# Altium schematic sheet main_logic.SchDoc
size A3; SheetNumber: 1; SheetTotal: 2
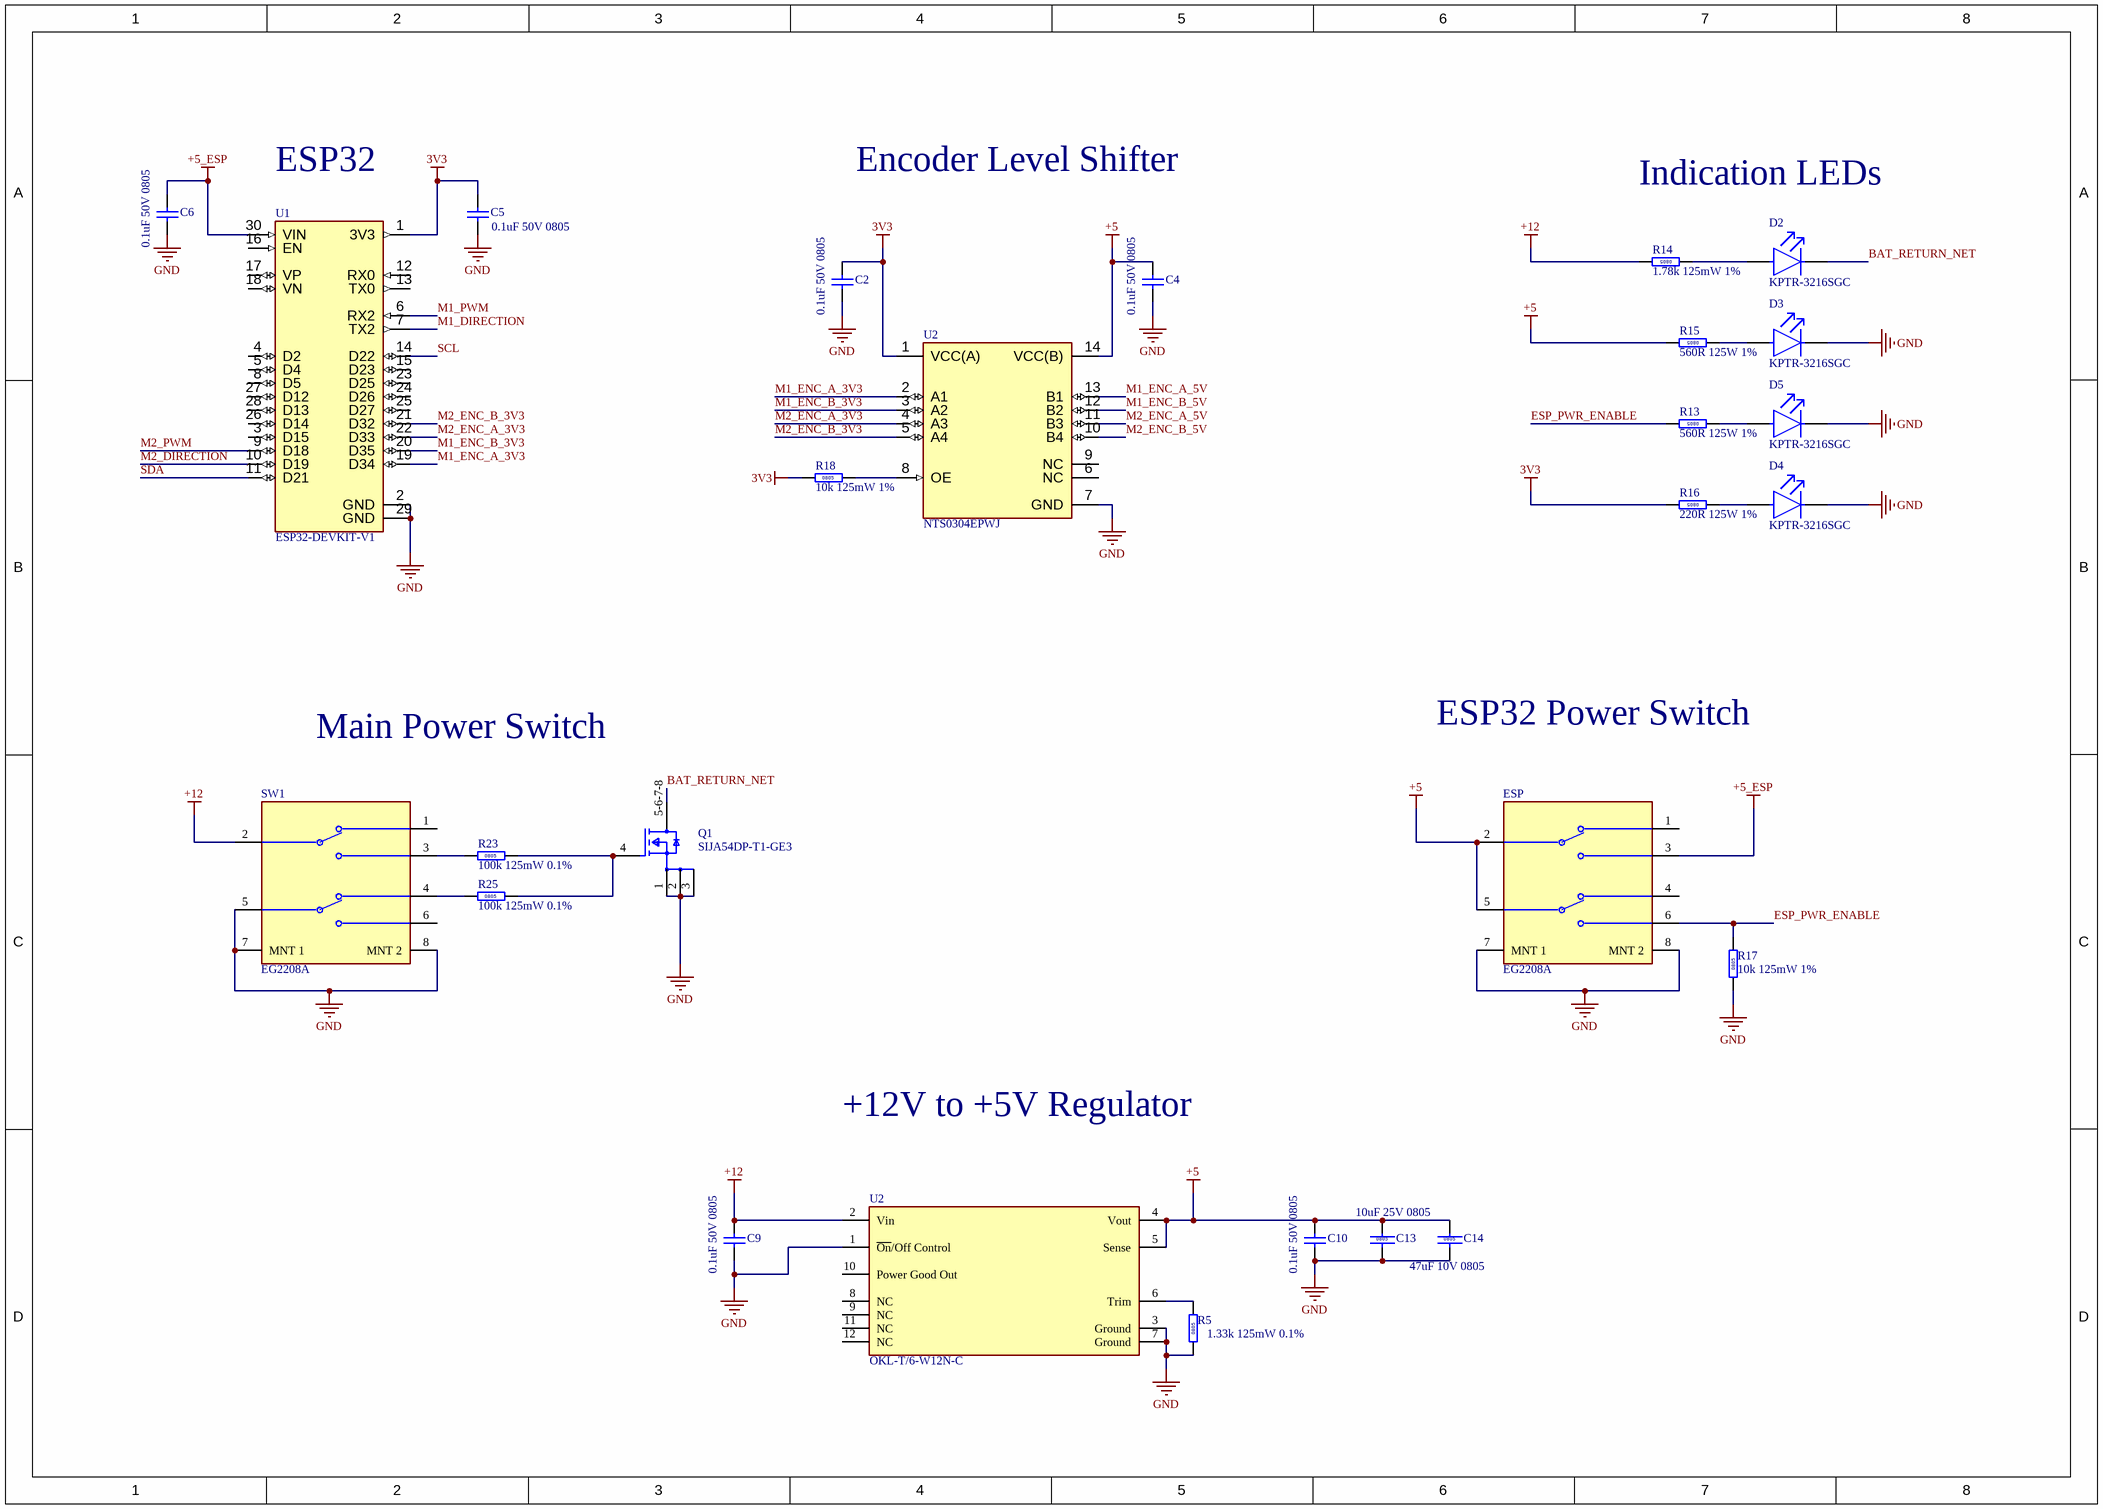
[diagram p0: main_logic.SchDoc]

## Parts
(Parts that share a designator on the sheet are numbered #1, #2 ... from top to bottom, then left to right.)
C2  0.1uF 50V 0805  [CAPC2012X14N]
C4  0.1uF 50V 0805  [CAPC2012X14N]
C5  0.1uF 50V 0805  [CAPC2012X14N]
C6  0.1uF 50V 0805  [CAPC2012X14N]
C9  0.1uF 50V 0805  [CAPC2012X14N]
C10  0.1uF 50V 0805  [CAPC2012X14N]
C13  10uF 25V 0805  [CAPC2012X14N]
C14  47uF 10V 0805  [CAPC2012X14N]
D2  KPTR-3216SGC  [KPTR-3216SGC-Footprint-1]
D3  KPTR-3216SGC  [KPTR-3216SGC-Footprint-1]
D4  KPTR-3216SGC  [KPTR-3216SGC-Footprint-1]
D5  KPTR-3216SGC  [KPTR-3216SGC-Footprint-1]
ESP  EG2208A  [FP-EG2208A-MFG]
Q1  SIJA54DP-T1-GE3  [SIJA54DP-T1-GE3-Footprint-2]
R5  1.33k 125mW 0.1%  [RESC2013X60X35ML10T20]
R13  560R 125W 1%  [RESC2013X60X35LL10T20]
R14  1.78k 125mW 1%  [RESC2013X60X35LL10T20]
R15  560R 125W 1%  [RESC2013X60X35LL10T20]
R16  220R 125W 1%  [RESC2013X60X35LL10T20]
R17  10k 125mW 1%  [RESC2013X60X35LL10T20]
R18  10k 125mW 1%  [RESC2013X60X35LL10T20]
R23  100k 125mW 0.1%  [RESC2013X60X35ML10T20]
R25  100k 125mW 0.1%  [RESC2013X60X35ML10T20]
SW1  EG2208A  [FP-EG2208A-MFG]
U1  ESP32-DEVKIT-V1  [MODULE_ESP32_DEVKIT_V1]
U2#1  NTS0304EPWJ  [FP-SOT402-1-MFG]
U2#2  OKL-T/6-W12N-C  [FP-OKL-T-6-W12-MFG]

## Nets
3V3: C2.2 C5.2 R16.2 R18.1 U1.1(3V3) U2#1.1(VCC(A))
+5: C4.2 C10.2 C13.1 C14.1 ESP.2(Com) ESP.5(Com) R15.2 U2#1.14(VCC(B)) U2#2.4(Vout) U2#2.5(Sense)
+5_ESP: C6.2 ESP.3 U1.30(VIN)
+12: C9.2 R14.2 SW1.2(Com) U2#2.2(Vin)
GND: C2.1 C4.1 C5.1 C6.1 C9.1 C10.1 C13.2 C14.2 D3.2(C) D4.2(C) D5.2(C) ESP.7(MNT_1) ESP.8(MNT_2) Q1.1(S) Q1.2(S) Q1.3(S) R5.1 R17.1 SW1.5(Com) SW1.7(MNT_1) SW1.8(MNT_2) U1.2(GND) U1.29(GND) U2#1.7(GND) U2#2.1(~{On}/Off_Control) U2#2.3(Ground) U2#2.7(Ground)
BAT_RETURN_NET: D2.2(C) Q1.5-6-7-8(D)
ESP_PWR_ENABLE: ESP.6 R13.2 R17.2
M1_DIRECTION: U1.7(TX2)
M1_ENC_A_3V3: U1.19(D34) U2#1.2(A1)
M1_ENC_A_5V: U2#1.13(B1)
M1_ENC_B_3V3: U1.20(D35) U2#1.3(A2)
M1_ENC_B_5V: U2#1.12(B2)
M1_PWM: U1.6(RX2)
M2_DIRECTION: U1.10(D19)
M2_ENC_A_3V3: U1.22(D33) U2#1.4(A3)
M2_ENC_A_5V: U2#1.11(B3)
M2_ENC_B_3V3: U1.21(D32) U2#1.5(A4)
M2_ENC_B_5V: U2#1.10(B4)
M2_PWM: U1.9(D18)
SCL: U1.14(D22)
SDA: U1.11(D21)
NetD2_1: D2.1(A) R14.1
NetD3_1: D3.1(A) R15.1
NetD4_1: D4.1(A) R16.1
NetD5_1: D5.1(A) R13.1
NetQ1_4: Q1.4(G) R23.2 R25.2
NetR5_2: R5.2 U2#2.6(Trim)
NetR18_2: R18.2 U2#1.8(OE)
NetR23_1: R23.1 SW1.3
NetR25_1: R25.1 SW1.4

Not connected (* = marked no-connect by the designer): ESP 1 4; SW1 1 6; U1 3(D15) 4(D2) 5(D4) 8(D5) 12(RX0) 13(TX0) 15(D23) 16(EN) 17(VP) 18(VN) 23(D25) 24(D26) 25(D27) 26(D14) 27(D12) 28(D13); U2#1 6(NC) 9(NC); U2#2 8(NC) 9(NC) 10(Power_Good_Out) 11(NC) 12(NC)

## Notes on the sheet
- ESP32
- Encoder Level Shifter
- Indication LEDs
- Main Power Switch
- ESP32 Power Switch
- +12V to +5V Regulator
- Sheet Title
- Design Title
- Sheet
- SIZE
- A4
- Designer
- PCB Code
- PCB Rev
- Approver
- Assembly Code
- Issue
- EC No.
- Approved Date

## Library data of the parts
C2 C4-C6 C9 C10 = CMP-40-005-00117-1: Cap, SMD, 0.1uF, 50V, 10%, 0805, X7R; Manufacturer: Samsung; ManufacturerPartNumber: CL21B104KBCWPNC; CapacitorType: Ceramic; Value: 100nF; ComponentLinkDescription: Datasheet; Package: 0805; MountingType: SMD; VoltageRating: 50V; Tolerance: 10%; ComponentLinkURL: https://octopart.com/part/samsung-electro-mechanics/CL21B104KBCWPNC; DielectricType: Ceramic
C13 = CMP-40-005-00031-7: Cap, SMD, 10uF, 25V, 10%, 0805, X5R; ManufacturerPartNumber: GRM21BR61E106; Manufacturer: Murata; Multilayer: Yes; CapacitorType: Ceramic; ComponentLinkDescription: Datasheet; Value: 10µF; Case/Package: 0805; Tolerance: 10%; Termination: Wraparound; Temperature Characteristics Code: X5R; Minimum Operating Temperature: -55°C; Tolerance (fill in as +-): 10%; Length: 2mm; ComponentLinkURL: https://datasheet.ciiva.com/pdfs/VipMasterIC/IC/MURE/MURE-S-A0008911298/MURE-S-A0008911412-1.pdf?src-supplier=IHS+Markit; Package Shape: Rectangular; Tolerance  (fill in as +-): 10%; Pins: 2; Terminal Finish: Nickel; DielectricType: Ceramic; Rated DC Voltage (URdc): 25V; Package Style: SMTMeter; Mounting Technology: Surface Mount; VoltageRating: 25V; Reach SVHC Compliant: Yes; JESD-609 Code: e3; Height: 1.25mm; Width: 1.25mm; RoHS Compliant: Yes; MountingType: SMD; Package: 0805; Maximum Operating Temperature: 85°C
C14 = CMP-40-005-00019-4: Cap, SMD, 47uF, 10V, 20%, 0805, X5R; ManufacturerPartNumber: GRM21BR61A476ME15L; Manufacturer: Murata; Value: 47µF; CapacitorType: Ceramic; ComponentLinkDescription: Datasheet; MountingType: SMD; VoltageRating: 10V; ComponentLinkURL: https://www.murata.com/en-global/products/productdetail?partno=GRM21BR61A476ME15%23; Tolerance: 20%; Package: 0805; DielectricType: X5R
D2-D5 = CMP-40-060-00012-7: Single Color LED, Super Bright Green, Water Clear, 1.6mm; Manufacturer: Kingbright; Reverse Voltage-Max: 5V; Overall Height: 1.05mm; Channels: 1; Luminous Intensity-Nom: 15mcd; Forward Voltage: 2.5V; Shape: Rectangular; Luminous Intensity-Min: 120cd; Viewing Angle: 120°; Forward Current: 25mA; ComponentLinkDescription: Datasheet; Terminal Pitch: 3.6mm; Size: 1.6mm; Colour: Super Bright Green; Min Operating Temperature: -40°C; Max Operating Temperature: 85°C; Package: 1206; ComponentLinkURL: https://datasheet.ciiva.com/pdfs/VipMasterIC/IC/KNGB/KNGBS03251/KNGBS03251-1.pdf?src-supplier=IHS+Markit; RoHS Compliant: Yes; Color@wavelength: Green; Maximum Operating Temperature: 85°C; Packaging: Tape and Reel; Minimum Operating Temperature: -40°C; ManufacturerPartNumber: KPTR-3216SGC; Pins: 2; Optoelectronic Device Type: SINGLE COLOR LED; Color: Green; MountingType: SMD; Reach SVHC Compliant: Yes; ForwardVoltage: 2.5V; Lens Style: WATER CLEAR; Mounting Technology: Surface Mount
ESP SW1 = CMP-17877-000003-1: SWITCH SLIDE DPDT 200MA 30V; Switch Travel: 2mm; Actuator Type: Standard; Switch Function: On-On; Actuator Length: 6mm; Operating Force: 200gf; Illumination Type: Non-Illuminated; Electrical Life: 10000Cycles; Number of Positions: 2; Contact Current Rating: 200mA; Contact Material: Copper Alloy; Throw Configuration: DPDT; RoHS Compliant: Yes; Lead Free: Lead Free; Termination: PC Pin; Package Quantity: 800; Current Rating: 200mA; REACH SVHC: No SVHC; Max Operating Temperature: 70°C; Min Operating Temperature: -25°C; Contact Plating: Silver; Voltage Rating (DC): 30V; Voltage Rating (AC): 30V; Mount: Through Hole; Orientation: Right Angle; Packaging: Bulk; Series: EG
Q1 = CMP-40-040-00025-2: Transistor, SMD, MOSFET, N-Chan, 40V; Manufacturer: Vishay; ComponentLinkDescription: Datasheet; CurrentRating: 60A; PowerRating: 36.7W; Minimum Operating Temperature: -55°C; Package: PowerPak SO-8; Breakdown Voltage: 40V; RoHS3Compliant: Yes; Maximum Operating Temperature: 150°C; TransistorType: MOSFET, N-Chan; ComponentLinkURL: https://datasheet.ciiva.com/pdfs/VipMasterIC/IC/VISH/VISH-S-A0002290573/VISH-S-A0002281459-1.pdf?src-supplier=IHS+Markit; MountingType: SMD; ManufacturerPartNumber: SIJA54DP-T1-GE3
R5 R23 R25 = CMP-40-025-00231-1: Res, SMD, 100k, 125mW, 0.1%, ±25ppm, 0805; Manufacturer: Panasonic; ManufacturerPartNumber: ERA-6AEB104V; Voltage Rating: 100V; ComponentLinkDescription: Datasheet; Package Height: 0.6; Power Rating: 125mW; Resistor Type: Fixed; RoHS3Certificate: https://download.siliconexpert.com/pdfs2/2024/6/2/9/59/48/925943/pns_/manual/erj6enf2700v_rohs.pdf; Mount: SMD; Case/Package: 0805; Composition: Thin Film; Temperature Coefficient (ppm/cel): ±25ppm; Min Operating Temperature: -55°C; ComponentLinkURL: https://octopart.com/era-6aeb104v-panasonic-1193246; Tolerance: 0.1%; Number of Pins: 2; Reach SVHC Compliant: Unaffected; RoHS3Compliant: Yes (with excemption); Contact Plating: Tin; Max Operating Temperature: 155°C; Resistance: 100k
R13 R15 R16 = CMP-40-025-00230-1: Res, SMD, 560R, 125mW, 1%, ±100ppm, 0805; Manufacturer: Panasonic; ManufacturerPartNumber: ERJ-6ENF5600V; Package Height: 0.6; ComponentLinkDescription: Datasheet; Voltage Rating: 150V; Resistance: 560; Max Operating Temperature: 155°C; Tolerance: 1%; Composition: Thick Film; Min Operating Temperature: -55°C; ComponentLinkURL: https://octopart.com/erj-6enf5600v-panasonic-55477609; RoHS3Compliant: Yes (with excemption); Case/Package: 0805; Mount: SMD; Contact Plating: Tin; RoHS3Certificate: https://download.siliconexpert.com/pdfs2/2024/6/2/9/59/48/925943/pns_/manual/erj6enf2700v_rohs.pdf; Number of Pins: 2; Power Rating: 125mW; Temperature Coefficient (ppm/cel): ±100ppm; Reach SVHC Compliant: Unaffected; Resistor Type: Fixed
R14 = CMP-40-025-00237-1: Res, SMD, 1.78k, 125mW, 1%, ±100ppm, 0805; Manufacturer: Panasonic; ManufacturerPartNumber: ERJ-6ENF1781V; ComponentLinkDescription: Datasheet; Voltage Rating: 150V; Package Height: 0.6mm; Power Rating: 125mW; Composition: Thick Film; RoHS3Compliant: Yes (with excemption); Number of Pins: 2; Resistance: 1.78k; Reach SVHC Compliant: Unaffected; Case/Package: 0805; Max Operating Temperature: 155°C; Mount: SMD; Resistor Type: Fixed; ComponentLinkURL: https://octopart.com/part/panasonic/ERJ-6ENF1781V; Min Operating Temperature: -55°C; Temperature Coefficient (ppm/cel): ±100ppm; Contact Plating: Tin; Tolerance: 1%
R17 R18 = CMP-40-025-00226-1: Res, SMD, 10k, 125mW, 1%, ±200ppm, 0805; Manufacturer: Panasonic; ManufacturerPartNumber: ERJ-6GEYJ103V; Package Height: 0.6mm; ComponentLinkDescription: Datasheet; Voltage Rating: 150V; Tolerance: 5%; RoHS3Certificate: https://download.siliconexpert.com/pdfs2/2024/6/2/9/59/48/925943/pns_/manual/erj6enf2700v_rohs.pdf; Composition: Thick Film; Contact Plating: Tin; Reach SVHC Compliant: Unaffected; ComponentLinkURL: https://octopart.com/erj-6geyj103v-panasonic-55422885; Temperature Coefficient (ppm/cel): ±200ppm; Resistance: 10k; Max Operating Temperature: 155°C; Mount: SMD; Number of Pins: 2; Case/Package: 0805; RoHS3Compliant: Yes (with exeption); Power Rating: 125mW; Resistor Type: Fixed; Min Operating Temperature: -55°C
U1 = ESP32-DEVKIT-V1: Dual core, Wi-Fi: 2.4 GHz up to 150 Mbits/s,BLE (Bluetooth Low Energy) and legacy Bluetooth, 32 bits, Up to 240 MHz; MF: Do it; SnapEDA_Link: https://www.snapeda.com/parts/ESP32-DEVKIT-V1/Do+it/view-part/?ref=snap; Package: None; Value: *; MP: ESP32-DEVKIT-V1; Check_prices: https://www.snapeda.com/parts/ESP32-DEVKIT-V1/Do+it/view-part/?ref=eda
U2#1 = CMP-10125-000002-1: 4-BIT VOLTAGE TRANSLATOR 14TSSOP; Manufacturer: NXP; Number Of Circuits: 4; Logic Function Desc: Translating Transceiver; Data Rate: 20Mbits/s; Standoff Height: 0.05mm; Min Supply Voltage: 0.95V; Nominal Supply Current: 2.2-18uA; V A Max: 4.6V; Max Supply Voltage: 5.5V; Max Junction Temp: +85°C; V B Min: -0.5V; V B Max: 6.5V; Propagation Delay: 5.3ns; Package: SOT402-1; Device Class L1: Integrated Circuits (ICs); Temperature Range High: +85°C; Number Of Outputs: 4; Temperature: -40°C to +85°C; Category: IC; Octopart: https://octopart.com/nts0304epwj-nxp+semiconductors-97865291; Ambient Temperature Range High: +125°C; Automotive: No; Device Class L3: Voltage Level Shifters; Digikey Description: 4-BIT VOLTAGE TRANSLATOR 14TSSOP; RoHS: TRUE; Lead Free: Yes; Manufacturer Part Number: NTS0304EPWJ; ComponentLink2Description: Datasheet; Number Of Inputs: 4; Footprint Url: https://www.nxp.com/docs/en/package-information/SOT402-1.pdf; Ambient Temperature Range Low: -40°C; Temperature Range Low: -40°C; V A Min: -0.5V; ComponentLink2URL: https://www.nxp.com/docs/en/data-sheet/NTS0304E.pdf; Device Class L2: Logic ICs; Height: 1.1mm
U2#2 = CMP-20596-000066-1: DC DC CONVERTER 0.591-5.5V 30W; Max Output Current: 6A; Nominal Input Voltage: 12V; Max Input Voltage (DC): 14V; Number of Outputs: 1; Min Input Voltage (DC): 4.5V; Nominal Output Voltage: 5.5V; Efficiency: 93%; Isolation: Non-Isolated; Min Output Voltage: 591mV; Height: 7.2mm; Depth: 12.19mm; Features: UVLO; Output Current: 6A; Operating Supply Voltage: 12V; Max Output Power: 30W; Series: Okami™ OKL-T/6-W12; Max Power Dissipation: 30W; Min Operating Temperature: -40°C; Width: 12.19mm; Mount: Surface Mount; Lead Free: Lead Free; Case/Package: LGA; Current - Output 1: 6A; REACH SVHC: No SVHC; Min Input Voltage: 4.5V; Max Input Voltage: 14V; Output Power: 30W; Packaging: Tape and Reel; Max Operating Temperature: 85°C; Package Quantity: 1; Number of Pins: 12; Output Voltage: 5.5V; Max Output Voltage: 5.5V; Length: 0.48inch; Power Rating: 30W; RoHS Compliant: Yes; Voltage - Output 1: 5.5V